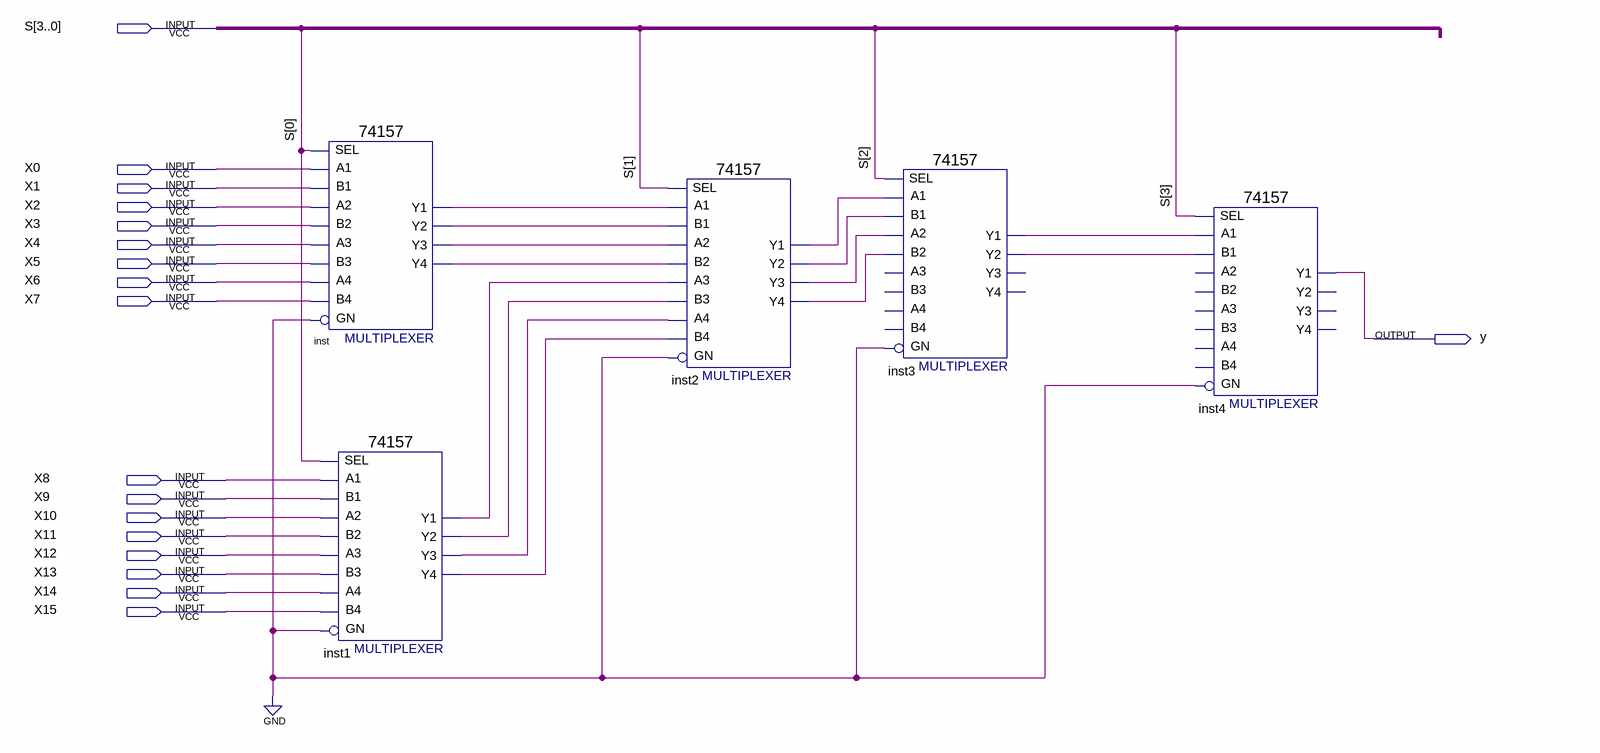
[diagram p0: schematic sheet]
// Quartus schematic Mux74157.bdf as structural Verilog: 5 symbols, 18 pins
module Mux74157 (
  input  [3:0] S,
  input  X0,
  input  X1,
  input  X2,
  input  X3,
  input  X4,
  input  X5,
  input  X6,
  input  X7,
  input  X8,
  input  X9,
  input  X10,
  input  X11,
  input  X12,
  input  X13,
  input  X14,
  input  X15,
  output y
);

  wire inst1_y1, inst1_y2, inst1_y3, inst1_y4, inst2_y1, inst2_y2, inst2_y3, inst2_y4, inst3_y1, inst3_y2,
       inst_y1, inst_y2, inst_y3, inst_y4;

  \74157  inst (
    .A1(X0), .B1(X1), .SEL(S[0]), .B2(X3), .A3(X4), .B3(X5), .A2(X2), .B4(X7), .GN(1'b0), .A4(X6),
    .Y2(inst_y2), .Y1(inst_y1), .Y4(inst_y4), .Y3(inst_y3));
  \74157  inst1 (
    .A1(X8), .B1(X9), .SEL(S[0]), .B2(X11), .A3(X12), .B3(X13), .A2(X10), .B4(X15), .GN(1'b0), .A4(X14),
    .Y2(inst1_y2), .Y1(inst1_y1), .Y4(inst1_y4), .Y3(inst1_y3));
  \74157  inst2 (
    .A1(inst_y1), .B1(inst_y2), .SEL(S[1]), .B2(inst_y4), .A3(inst1_y1), .B3(inst1_y2), .A2(inst_y3),
    .B4(inst1_y4), .GN(1'b0), .A4(inst1_y3), .Y2(inst2_y2), .Y1(inst2_y1), .Y4(inst2_y4), .Y3(inst2_y3));
  \74157  inst3 (
    .A1(inst2_y1), .B1(inst2_y2), .SEL(S[2]), .B2(inst2_y4), .A2(inst2_y3), .GN(1'b0), .Y2(inst3_y2),
    .Y1(inst3_y1));  // open: A3, B3, B4, A4, Y4, Y3
  \74157  inst4 (
    .A1(inst3_y1), .B1(inst3_y2), .SEL(S[3]), .GN(1'b0), .Y1(y));  // open: B2, A3, B3, A2, B4, A4, Y2, Y4, Y3
endmodule
